# Altium schematic sheet Optoacoplador.SchDoc
size A4
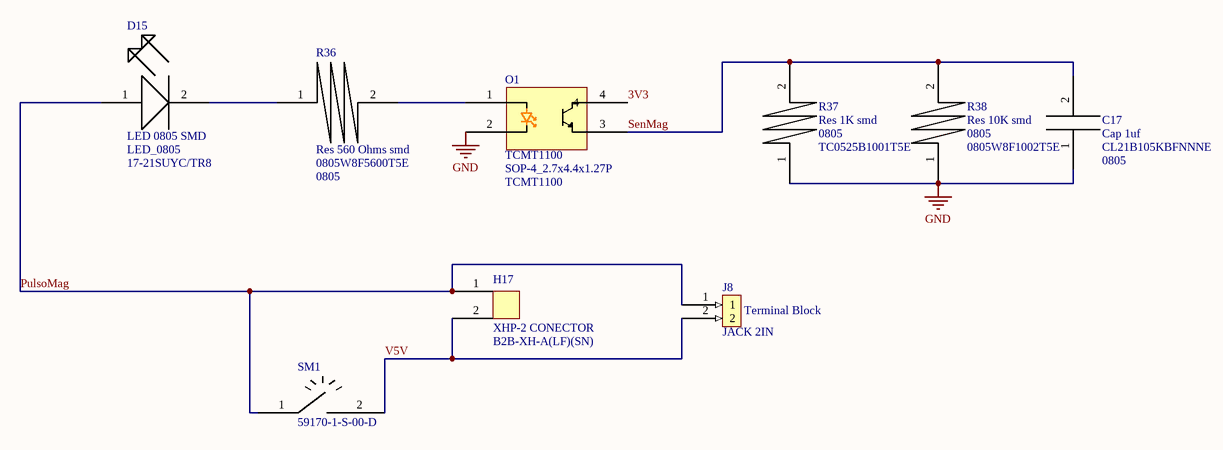
[diagram p0: Optoacoplador.SchDoc]

## Parts
C17  Cap 1uf  MFR.Part #: CL21B105KBFNNNE  Package: 0805  [CAP 1UFSMD]
D15  LED 0805 SMD  Package: LED_0805  MFR.Part #: 17-21SUYC/TR8  [LED SMD Amarillo]
H17  XHP-2 CONECTOR  [CONECTOR 2 PINES]
J8  JACK 2IN  [Terminal Blocks 2in]
O1  TCMT1100  Package: SOP-4_2.7x4.4x1.27P  [TCMT110]
R36  Res 560 Ohms smd  MFR.Part #: 0805W8F5600T5E  Package: 0805  [RES 560]
R37  Res 1K smd  Package: 0805  MFR.Part #: TC0525B1001T5E  [RES 1K]
R38  Res 10K smd  Package: 0805  MFR.Part #: 0805W8F1002T5E  [RES 10K]
SM1  59170-1-S-00-D  [Switch Magnetico]

## Nets
GND: C17.1 O1.2 R37.1 R38.1
3V3: O1.4
PulsoMag: D15.1 H17.1 J8.1 SM1.1
SenMag: C17.2 O1.3 R37.2 R38.2
V5V: H17.2 J8.2 SM1.2
NetD15_2: D15.2 R36.1
NetO1_1: O1.1 R36.2

## Notes on the sheet
- (in symbol JACK 2IN) Terminal Block

## Library data of the parts
D15 = LED 0805 SMD: LED 0805 Yellow
H17 = B2B-XH-A(LF)(SN): CONECTOR JST-XH 2 PINES; SUPPLIER NUMBER PART: B2B-XH-A(LF)(SN)
J8 = JACK 2IN: Pluggable Terminal Blocks WR-TBL Mod312 5.08mm 2Pin Opn Hztl PCBHdr; Manufacturer: Wurth Electronics; Manufacturer Part Number: 691312510002; Current Rating: 20 A; Mounting Angle: Horizontal; Mounting Method: PCB; Number of Positions: 2 Position; Voltage Rating: 300 V; Supplier 1: Mouser; RoHS: RoHS Compliant; Category: Pluggable Terminal Blocks; Stock 1: 413; Pricing 1: 1=0.528, 10=0.499, 50=0.475, 100=0.453, 500=0.429, 1000=0.416 (AUD); Color: Green; Connection Method: -; Contact Plating: Tin; Housing Material: Polybutylene Terephthalate (PBT); Packaging: Bulk; Product: Headers; Series: WR-TBL; Termination Style: Through Hole; Brand: Wurth Electronics; Contact Material: Brass; Flammability Rating: UL 94 V-0; Pitch: 5.08 mm; Wire Gauge Range: -; Wire Orientation: Horizontal; RoHS - Mouser: Y; Minimum Order Quantity: 1; Reeling: False; ComponentLink1URL: http://www.mouser.com/ds/2/445/6913125100xx-537850.pdf; ComponentLink1Description: http://www.mouser.com/ds/2/445/6913125100xx-537850.pdf; Supplier Part Number 1: 710-691312510002
O1 = TCMT110: MFR.Part #: TCMT1100
R38 = Res 10K smd: 10K
SM1 = 59170-1-S-00-D: MFR.Part #: 59170-1-S-00-D; Package: SENSOR-SMD